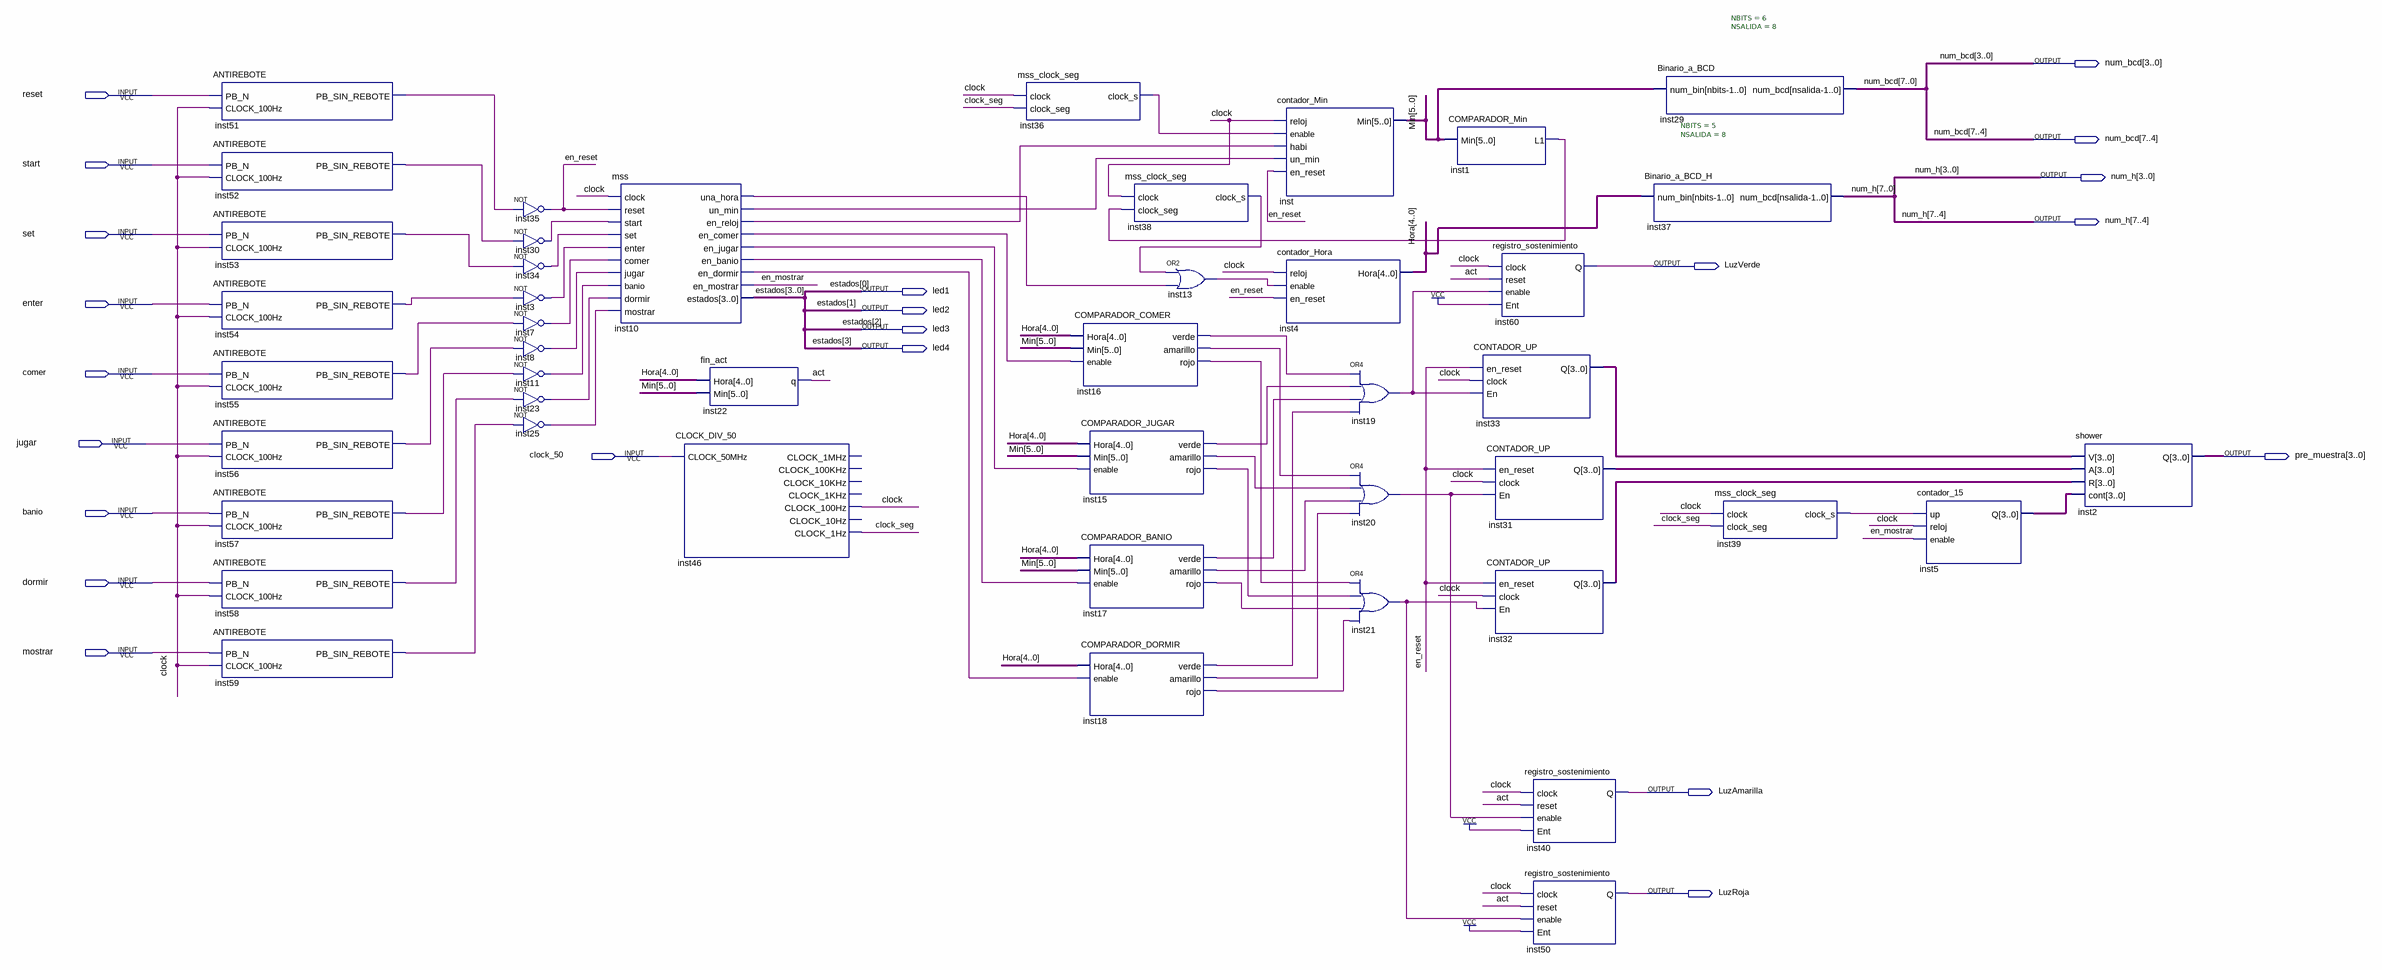
[diagram p0: schematic sheet]
// Quartus schematic PET.bdf as structural Verilog: 45 symbols, 22 pins
module PET (
  input  reset,
  input  start,
  input  set,
  input  enter,
  input  comer,
  input  jugar,
  input  clock_50,
  input  banio,
  input  dormir,
  input  mostrar,
  output [7:0] num_bcd,
  output [7:0] num_h,
  output LuzVerde,
  output led1,
  output led2,
  output led3,
  output led4,
  output [3:0] pre_muestra,
  output LuzAmarilla,
  output LuzRoja
);

  wire act, clock, clock_seg, en_mostrar, en_reset, inst1_l1, inst3_out, inst7_out, inst8_out,
       inst10_en_banio, inst10_en_comer, inst10_en_dormir, inst10_en_jugar, inst10_en_reloj, inst10_un_min,
       inst10_una_hora, inst11_out, inst13_out, inst15_amarillo, inst15_rojo, inst15_verde, inst16_amarillo,
       inst16_rojo, inst16_verde, inst17_amarillo, inst17_rojo, inst17_verde, inst18_amarillo, inst18_rojo,
       inst18_verde, inst19_out, inst20_out, inst21_out, inst23_out, inst25_out, inst30_out, inst34_out,
       inst36_clock_s, inst38_clock_s, inst39_clock_s, inst51_pb_sin_rebote, inst52_pb_sin_rebote,
       inst53_pb_sin_rebote, inst54_pb_sin_rebote, inst55_pb_sin_rebote, inst56_pb_sin_rebote,
       inst57_pb_sin_rebote, inst58_pb_sin_rebote, inst59_pb_sin_rebote;
  wire [3:0] inst5_q, inst31_q, inst32_q, inst33_q;
  wire [4:0] Hora;
  wire [5:0] Min;

  ANTIREBOTE inst51 (.PB_N(reset), .CLOCK_100Hz(clock), .PB_SIN_REBOTE(inst51_pb_sin_rebote));
  ANTIREBOTE inst52 (.PB_N(start), .CLOCK_100Hz(clock), .PB_SIN_REBOTE(inst52_pb_sin_rebote));
  ANTIREBOTE inst53 (.PB_N(set), .CLOCK_100Hz(clock), .PB_SIN_REBOTE(inst53_pb_sin_rebote));
  ANTIREBOTE inst54 (.PB_N(enter), .CLOCK_100Hz(clock), .PB_SIN_REBOTE(inst54_pb_sin_rebote));
  ANTIREBOTE inst55 (.PB_N(comer), .CLOCK_100Hz(clock), .PB_SIN_REBOTE(inst55_pb_sin_rebote));
  ANTIREBOTE inst56 (.PB_N(jugar), .CLOCK_100Hz(clock), .PB_SIN_REBOTE(inst56_pb_sin_rebote));
  ANTIREBOTE inst57 (.PB_N(banio), .CLOCK_100Hz(clock), .PB_SIN_REBOTE(inst57_pb_sin_rebote));
  ANTIREBOTE inst58 (.PB_N(dormir), .CLOCK_100Hz(clock), .PB_SIN_REBOTE(inst58_pb_sin_rebote));
  ANTIREBOTE inst59 (.PB_N(mostrar), .CLOCK_100Hz(clock), .PB_SIN_REBOTE(inst59_pb_sin_rebote));
  not inst35 (en_reset, inst51_pb_sin_rebote);
  not inst30 (inst30_out, inst52_pb_sin_rebote);
  not inst34 (inst34_out, inst53_pb_sin_rebote);
  not inst3 (inst3_out, inst54_pb_sin_rebote);
  not inst7 (inst7_out, inst55_pb_sin_rebote);
  not inst8 (inst8_out, inst56_pb_sin_rebote);
  not inst11 (inst11_out, inst57_pb_sin_rebote);
  not inst23 (inst23_out, inst58_pb_sin_rebote);
  not inst25 (inst25_out, inst59_pb_sin_rebote);
  mss inst10 (
    .clock(clock), .reset(en_reset), .start(inst30_out), .set(inst34_out), .enter(inst3_out),
    .comer(inst7_out), .jugar(inst8_out), .banio(inst11_out), .dormir(inst23_out), .mostrar(inst25_out),
    .una_hora(inst10_una_hora), .un_min(inst10_un_min), .en_reloj(inst10_en_reloj),
    .en_comer(inst10_en_comer), .en_jugar(inst10_en_jugar), .en_banio(inst10_en_banio),
    .en_dormir(inst10_en_dormir), .en_mostrar(en_mostrar), .estados({led4, led3, led2, led1}));
  CLOCK_DIV_50 inst46 (
    .CLOCK_50MHz(clock_50), .CLOCK_100Hz(clock), .CLOCK_1Hz(clock_seg));  // open: CLOCK_1MHz, CLOCK_100KHz, CLOCK_10KHz, CLOCK_1KHz, CLOCK_10Hz
  fin_act inst22 (.Hora(Hora), .Min(Min), .q(act));
  mss_clock_seg inst36 (.clock(clock), .clock_seg(clock_seg), .clock_s(inst36_clock_s));
  COMPARADOR_COMER inst16 (
    .Hora(Hora), .Min(Min), .enable(inst10_en_comer), .verde(inst16_verde), .amarillo(inst16_amarillo),
    .rojo(inst16_rojo));
  COMPARADOR_JUGAR inst15 (
    .Hora(Hora), .Min(Min), .enable(inst10_en_jugar), .verde(inst15_verde), .amarillo(inst15_amarillo),
    .rojo(inst15_rojo));
  COMPARADOR_BANIO inst17 (
    .Hora(Hora), .Min(Min), .enable(inst10_en_banio), .verde(inst17_verde), .amarillo(inst17_amarillo),
    .rojo(inst17_rojo));
  COMPARADOR_DORMIR inst18 (
    .Hora(Hora), .enable(inst10_en_dormir), .verde(inst18_verde), .amarillo(inst18_amarillo),
    .rojo(inst18_rojo));
  mss_clock_seg inst38 (.clock(clock), .clock_seg(inst1_l1), .clock_s(inst38_clock_s));
  or inst13 (inst13_out, inst38_clock_s, inst10_una_hora);
  contador_Min inst (
    .reloj(clock), .enable(inst36_clock_s), .habi(inst10_en_reloj), .un_min(inst10_un_min),
    .en_reset(en_reset), .Min(Min));
  contador_Hora inst4 (.reloj(clock), .enable(inst13_out), .en_reset(en_reset), .Hora(Hora));
  or inst19 (inst19_out, inst16_verde, inst15_verde, inst17_verde, inst18_verde);
  or inst20 (inst20_out, inst16_amarillo, inst15_amarillo, inst17_amarillo, inst18_amarillo);
  or inst21 (inst21_out, inst16_rojo, inst15_rojo, inst17_rojo, inst18_rojo);
  COMPARADOR_Min inst1 (.Min(Min), .L1(inst1_l1));
  registro_sostenimiento inst60 (.clock(clock), .reset(act), .enable(inst19_out), .Ent(1'b1), .Q(LuzVerde));
  CONTADOR_UP inst33 (.en_reset(en_reset), .clock(clock), .En(inst19_out), .Q(inst33_q));
  CONTADOR_UP inst31 (.en_reset(en_reset), .clock(clock), .En(inst20_out), .Q(inst31_q));
  CONTADOR_UP inst32 (.en_reset(en_reset), .clock(clock), .En(inst21_out), .Q(inst32_q));
  registro_sostenimiento inst40 (.clock(clock), .reset(act), .enable(inst20_out), .Ent(1'b1), .Q(LuzAmarilla));
  registro_sostenimiento inst50 (.clock(clock), .reset(act), .enable(inst21_out), .Ent(1'b1), .Q(LuzRoja));
  Binario_a_BCD_H #(.NBITS(5), .NSALIDA(8)) inst37 (.num_bin(Hora), .num_bcd(num_h));
  Binario_a_BCD #(.NBITS(6), .NSALIDA(8)) inst29 (.num_bin(Min), .num_bcd(num_bcd));
  mss_clock_seg inst39 (.clock(clock), .clock_seg(clock_seg), .clock_s(inst39_clock_s));
  contador_15 inst5 (.up(inst39_clock_s), .reloj(clock), .enable(en_mostrar), .Q(inst5_q));
  shower inst2 (.V(inst33_q), .A(inst31_q), .R(inst32_q), .cont(inst5_q), .Q(pre_muestra));

  // Other names for the same wires on the sheet: estados[3:0] = {led4, led3, led2, led1}
endmodule
